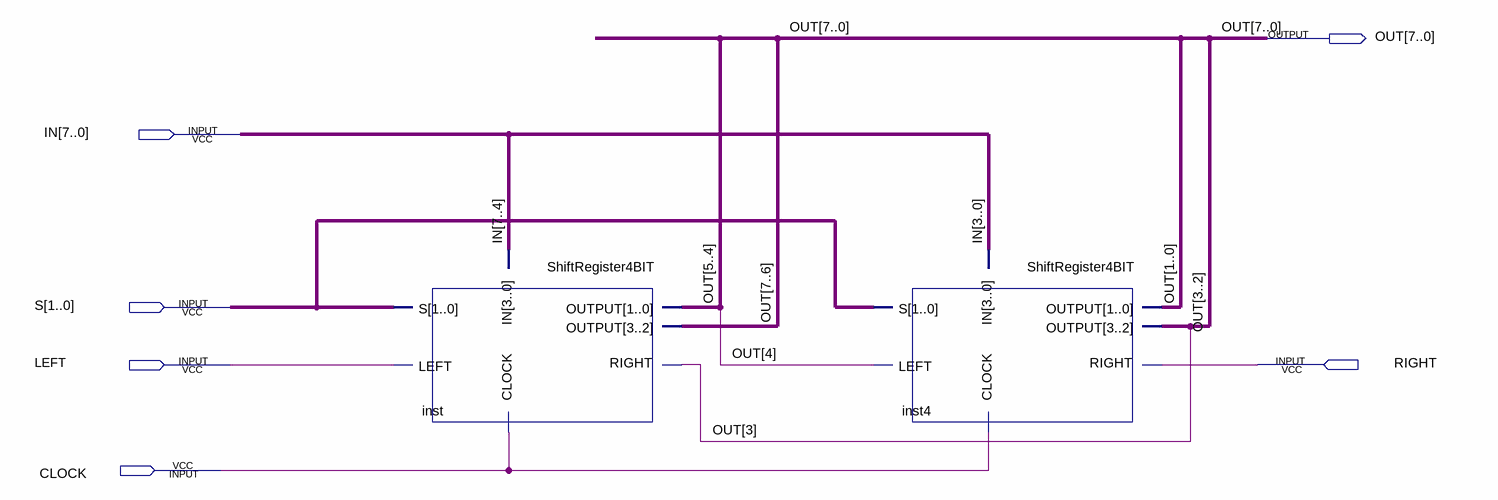
[diagram p0: schematic sheet]
// Quartus schematic ShiftRegister.bdf as structural Verilog: 2 symbols, 6 pins
module ShiftRegister (
  input  [7:0] IN,
  input  [1:0] S,
  input  LEFT,
  input  RIGHT,
  input  CLOCK,
  output [7:0] OUT
);

  ShiftRegister4BIT inst (.S(S), .IN(IN[7:4]), .LEFT(LEFT), .RIGHT(OUT[3]), .CLOCK(CLOCK), .OUTPUT(OUT[7:4]));
  ShiftRegister4BIT inst4 (.S(S), .IN(IN[3:0]), .LEFT(OUT[4]), .RIGHT(RIGHT), .CLOCK(CLOCK), .OUTPUT(OUT[3:0]));
endmodule
